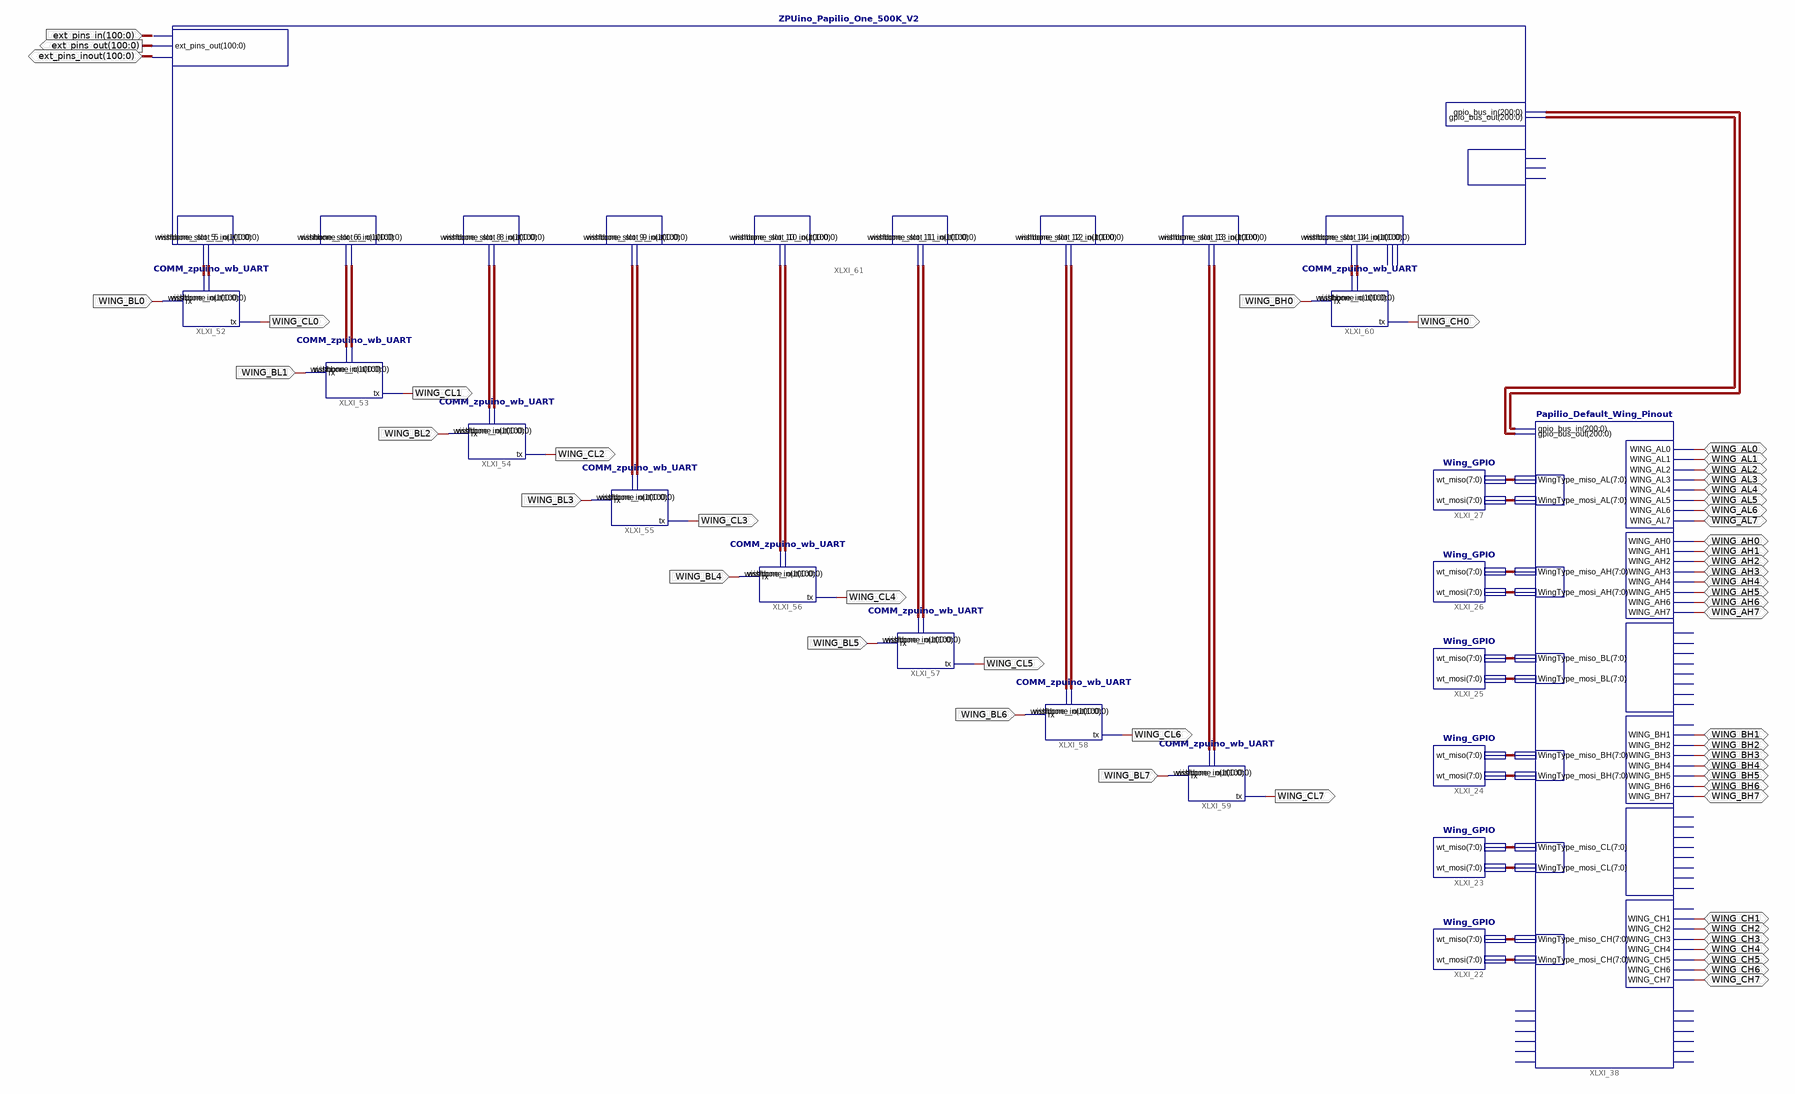
[diagram p0: schematic sheet 1]
// Xilinx ISE schematic Papilio_One_500K.sch (spartan3e) as structural Verilog: 17 symbols, 51 ports
module Papilio_One_500K (
  input  [100:0] ext_pins_in,
  input  WING_BL0,
  input  WING_BH0,
  input  WING_BL1,
  input  WING_BL2,
  input  WING_BL3,
  input  WING_BL4,
  input  WING_BL5,
  input  WING_BL6,
  input  WING_BL7,
  inout  WING_AH0,
  inout  WING_AH1,
  inout  WING_AH2,
  inout  WING_AH3,
  inout  WING_AH4,
  inout  WING_AH5,
  inout  WING_AH6,
  inout  WING_AH7,
  inout  WING_BH1,
  inout  WING_BH2,
  inout  WING_BH3,
  inout  WING_BH4,
  inout  WING_BH5,
  inout  WING_BH6,
  inout  WING_BH7,
  inout  WING_CH1,
  inout  WING_CH2,
  inout  WING_CH3,
  inout  WING_CH4,
  inout  WING_CH5,
  inout  WING_CH6,
  inout  WING_CH7,
  inout  [100:0] ext_pins_inout,
  inout  WING_AL0,
  inout  WING_AL1,
  inout  WING_AL2,
  inout  WING_AL3,
  inout  WING_AL4,
  inout  WING_AL5,
  inout  WING_AL6,
  inout  WING_AL7,
  output [100:0] ext_pins_out,
  output WING_CL0,
  output WING_CH0,
  output WING_CL1,
  output WING_CL2,
  output WING_CL3,
  output WING_CL4,
  output WING_CL5,
  output WING_CL6,
  output WING_CL7
);

  wire [7:0] XLXN_325, XLXN_326, XLXN_327, XLXN_328, XLXN_329, XLXN_330, XLXN_331, XLXN_332, XLXN_333,
       XLXN_334, XLXN_335, XLXN_336;
  wire [100:0] XLXN_481, XLXN_482, XLXN_483, XLXN_484, XLXN_485, XLXN_486, XLXN_487, XLXN_488, XLXN_489,
       XLXN_490, XLXN_491, XLXN_492, XLXN_493, XLXN_494, XLXN_495, XLXN_496, XLXN_497, XLXN_498;
  wire [200:0] XLXN_408, XLXN_409;

  Wing_GPIO XLXI_27 (.wt_miso(XLXN_335), .wt_mosi(XLXN_336));
  Wing_GPIO XLXI_26 (.wt_miso(XLXN_333), .wt_mosi(XLXN_334));
  Wing_GPIO XLXI_25 (.wt_miso(XLXN_331), .wt_mosi(XLXN_332));
  Wing_GPIO XLXI_24 (.wt_miso(XLXN_329), .wt_mosi(XLXN_330));
  Wing_GPIO XLXI_23 (.wt_miso(XLXN_327), .wt_mosi(XLXN_328));
  Wing_GPIO XLXI_22 (.wt_miso(XLXN_325), .wt_mosi(XLXN_326));
  Papilio_Default_Wing_Pinout XLXI_38 (
    .WING_AH0(WING_AH0), .WING_AH1(WING_AH1), .WING_AH2(WING_AH2), .WING_AH3(WING_AH3), .WING_AH4(WING_AH4),
    .WING_AH5(WING_AH5), .WING_AH6(WING_AH6), .WING_AH7(WING_AH7), .WING_AL0(WING_AL0), .WING_AL1(WING_AL1),
    .WING_AL2(WING_AL2), .WING_AL3(WING_AL3), .WING_AL4(WING_AL4), .WING_AL5(WING_AL5), .WING_AL6(WING_AL6),
    .WING_AL7(WING_AL7), .WING_BH1(WING_BH1), .WING_BH2(WING_BH2), .WING_BH3(WING_BH3), .WING_BH4(WING_BH4),
    .WING_BH5(WING_BH5), .WING_BH6(WING_BH6), .WING_BH7(WING_BH7), .WING_CH1(WING_CH1), .WING_CH2(WING_CH2),
    .WING_CH3(WING_CH3), .WING_CH4(WING_CH4), .WING_CH5(WING_CH5), .WING_CH6(WING_CH6), .WING_CH7(WING_CH7),
    .gpio_bus_out(XLXN_408), .gpio_bus_in(XLXN_409), .WingType_miso_BH(XLXN_329),
    .WingType_miso_BL(XLXN_331), .WingType_miso_AH(XLXN_333), .WingType_mosi_BL(XLXN_332),
    .WingType_mosi_BH(XLXN_330), .WingType_mosi_CL(XLXN_328), .WingType_mosi_AH(XLXN_334),
    .WingType_miso_CL(XLXN_327), .WingType_miso_CH(XLXN_325), .WingType_mosi_CH(XLXN_326),
    .WingType_mosi_AL(XLXN_336), .WingType_miso_AL(XLXN_335));  // open: WING_BH0, WING_BL0, WING_BL1, WING_BL2, WING_BL3, WING_BL4, WING_BL5, WING_BL6, WING_BL7, WING_CL0, WING_CL1, WING_CL2, WING_CL3, WING_CL4, WING_CL5, WING_CL6, WING_CL7, WING_CH0, Flex_Pin_out_0, Flex_Pin_out_1, Flex_Pin_out_2, Flex_Pin_out_3, Flex_Pin_out_4, Flex_Pin_out_5, Flex_Pin_in_0, Flex_Pin_in_1, Flex_Pin_in_2, Flex_Pin_in_3, Flex_Pin_in_4, Flex_Pin_in_5
  COMM_zpuino_wb_UART XLXI_52 (.rx(WING_BL0), .wishbone_in(XLXN_481), .wishbone_out(XLXN_482), .tx(WING_CL0));
  COMM_zpuino_wb_UART XLXI_53 (.rx(WING_BL1), .wishbone_in(XLXN_483), .wishbone_out(XLXN_484), .tx(WING_CL1));
  COMM_zpuino_wb_UART XLXI_54 (.rx(WING_BL2), .wishbone_in(XLXN_485), .wishbone_out(XLXN_486), .tx(WING_CL2));
  COMM_zpuino_wb_UART XLXI_55 (.rx(WING_BL3), .wishbone_in(XLXN_487), .wishbone_out(XLXN_488), .tx(WING_CL3));
  COMM_zpuino_wb_UART XLXI_56 (.rx(WING_BL4), .wishbone_in(XLXN_489), .wishbone_out(XLXN_490), .tx(WING_CL4));
  COMM_zpuino_wb_UART XLXI_57 (.rx(WING_BL5), .wishbone_in(XLXN_491), .wishbone_out(XLXN_492), .tx(WING_CL5));
  COMM_zpuino_wb_UART XLXI_58 (.rx(WING_BL6), .wishbone_in(XLXN_493), .wishbone_out(XLXN_494), .tx(WING_CL6));
  COMM_zpuino_wb_UART XLXI_59 (.rx(WING_BL7), .wishbone_in(XLXN_495), .wishbone_out(XLXN_496), .tx(WING_CL7));
  COMM_zpuino_wb_UART XLXI_60 (.rx(WING_BH0), .wishbone_in(XLXN_497), .wishbone_out(XLXN_498), .tx(WING_CH0));
  ZPUino_Papilio_One_500K_V2 XLXI_61 (
    .ext_pins_in(ext_pins_in), .ext_pins_out(ext_pins_out), .ext_pins_inout(ext_pins_inout),
    .gpio_bus_out(XLXN_408), .gpio_bus_in(XLXN_409), .wishbone_slot_5_out(XLXN_482),
    .wishbone_slot_5_in(XLXN_481), .wishbone_slot_6_in(XLXN_483), .wishbone_slot_6_out(XLXN_484),
    .wishbone_slot_8_in(XLXN_485), .wishbone_slot_8_out(XLXN_486), .wishbone_slot_9_in(XLXN_487),
    .wishbone_slot_9_out(XLXN_488), .wishbone_slot_10_in(XLXN_489), .wishbone_slot_10_out(XLXN_490),
    .wishbone_slot_11_in(XLXN_491), .wishbone_slot_11_out(XLXN_492), .wishbone_slot_12_in(XLXN_493),
    .wishbone_slot_12_out(XLXN_494), .wishbone_slot_13_in(XLXN_495), .wishbone_slot_13_out(XLXN_496),
    .wishbone_slot_14_in(XLXN_497), .wishbone_slot_14_out(XLXN_498));  // open: clk_96Mhz, clk_1Mhz, clk_osc_32Mhz, wishbone_slot_video_in, wishbone_slot_video_out, vgaclkout
endmodule
